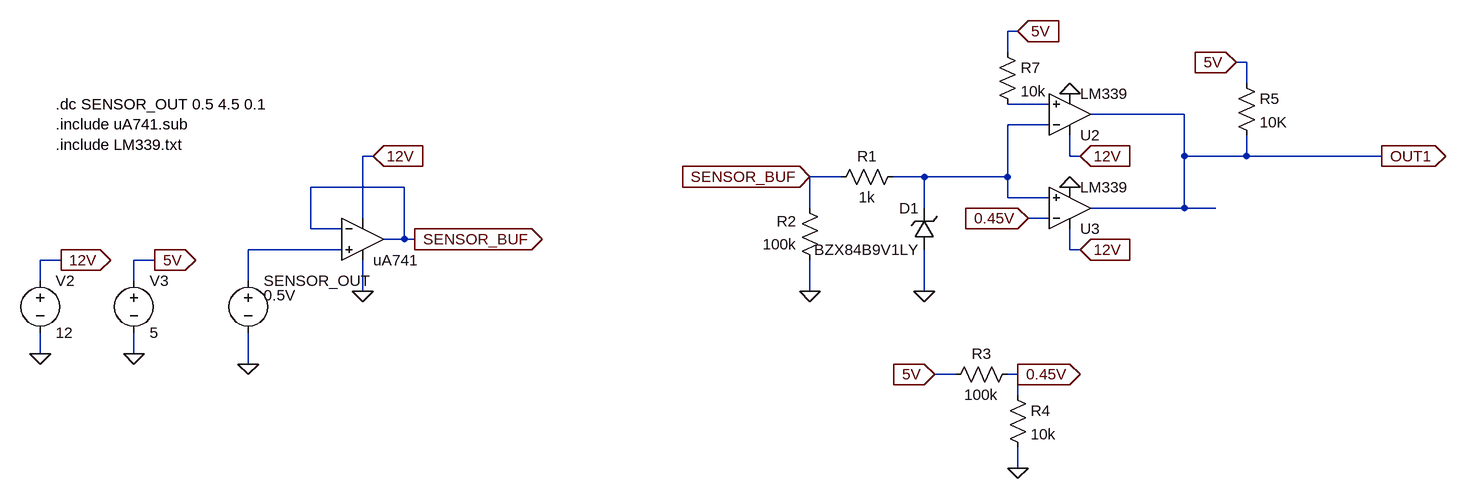
[diagram p0: schematic BSPD Sensors.asc]
BSPD Sensors.asc, the LTspice schematic file:
Version 4
SHEET 1 1704 752
WIRE 992 64 976 64
WIRE 976 96 976 64
WIRE 1344 112 1328 112
WIRE 1344 144 1344 112
WIRE 1040 176 976 176
WIRE 1248 192 1104 192
WIRE 1040 208 976 208
WIRE 0 256 -16 256
WIRE 1072 256 1072 224
WIRE 1088 256 1072 256
WIRE 1248 256 1248 192
WIRE 1344 256 1344 224
WIRE 1344 256 1248 256
WIRE 1552 256 1344 256
WIRE 720 288 672 288
WIRE 848 288 800 288
WIRE 976 288 976 208
WIRE 976 288 848 288
WIRE 48 304 -96 304
WIRE 976 320 976 288
WIRE 1040 320 976 320
WIRE 672 336 672 288
WIRE 848 336 848 288
WIRE 1248 336 1248 256
WIRE 1248 336 1104 336
WIRE 1296 336 1248 336
WIRE -16 352 -16 256
WIRE 1040 352 1008 352
WIRE -96 368 -96 304
WIRE -48 368 -96 368
WIRE 48 384 48 304
WIRE 48 384 16 384
WIRE 64 384 48 384
WIRE -48 400 -192 400
WIRE 1072 400 1072 368
WIRE 1088 400 1072 400
WIRE -480 416 -512 416
WIRE -336 416 -368 416
WIRE -512 448 -512 416
WIRE -368 448 -368 416
WIRE -192 448 -192 400
WIRE -16 464 -16 416
WIRE 672 464 672 416
WIRE 848 464 848 400
WIRE -512 560 -512 528
WIRE -368 560 -368 528
WIRE -192 576 -192 528
WIRE 896 592 864 592
WIRE 992 592 976 592
WIRE 992 624 992 592
WIRE 992 736 992 704
FLAG -512 560 0
FLAG -480 416 12V
IOPIN -480 416 Out
FLAG -368 560 0
FLAG -336 416 5V
IOPIN -336 416 Out
FLAG -192 576 0
FLAG 64 384 SENSOR_BUF
IOPIN 64 384 Out
FLAG -16 464 0
FLAG 0 256 12V
IOPIN 0 256 In
FLAG 672 464 0
FLAG 848 464 0
FLAG 672 288 SENSOR_BUF
IOPIN 672 288 In
FLAG 992 736 0
FLAG 864 592 5V
IOPIN 864 592 In
FLAG 992 592 0.45V
IOPIN 992 592 Out
FLAG 1008 352 0.45V
IOPIN 1008 352 In
FLAG 1072 304 0
FLAG 1072 160 0
FLAG 1088 256 12V
IOPIN 1088 256 In
FLAG 1088 400 12V
IOPIN 1088 400 In
FLAG 1328 112 5V
IOPIN 1328 112 In
FLAG 1552 256 OUT1
IOPIN 1552 256 Out
FLAG 992 64 5V
IOPIN 992 64 In
SYMBOL voltage -192 432 R0
WINDOW 3 24 38 Left 2
SYMATTR Value 0.5V
SYMATTR InstName SENSOR_OUT
SYMBOL OpAmps/opamp2 -16 320 R0
WINDOW 0 16 32 Invisible 2
SYMATTR InstName U1
SYMATTR Value uA741
SYMBOL voltage -512 432 R0
SYMATTR InstName V2
SYMATTR Value 12
SYMBOL voltage -368 432 R0
SYMATTR InstName V3
SYMATTR Value 5
SYMBOL Res 816 272 R90
WINDOW 0 0 56 VBottom 2
WINDOW 3 32 56 VTop 2
SYMATTR InstName R1
SYMATTR Value 1k
SYMBOL Res 688 432 R180
WINDOW 0 36 76 Left 2
WINDOW 3 36 40 Left 2
SYMATTR InstName R2
SYMATTR Value 100k
SYMBOL OpAmps/opamp2 1072 256 M180
SYMATTR InstName U2
SYMATTR Value LM339
SYMBOL OpAmps/opamp2 1072 400 M180
SYMATTR InstName U3
SYMATTR Value LM339
SYMBOL Res 880 608 R270
WINDOW 0 32 56 VTop 2
WINDOW 3 0 56 VBottom 2
SYMATTR InstName R3
SYMATTR Value 100k
SYMBOL Res 976 608 R0
SYMATTR InstName R4
SYMATTR Value 10k
SYMBOL Res 1328 128 R0
SYMATTR InstName R5
SYMATTR Value 10K
SYMBOL Res 960 80 R0
SYMATTR InstName R7
SYMATTR Value 10k
SYMBOL zener 864 400 R180
WINDOW 0 24 64 Left 2
WINDOW 3 24 0 Left 2
SYMATTR InstName D1
SYMATTR Value BZX84B9V1LY
TEXT -488 176 Left 2 !.dc SENSOR_OUT 0.5 4.5 0.1\n.include uA741.sub\n.include LM339.txt

The netlist it stands for:
* BSPD Sensors.asc
V§SENSOR_OUT N003 0 0.5V
XU1 N003 SENSOR_BUF 12V 0 SENSOR_BUF uA741  ; pins In+ In- V+ V- OUT
V2 12V 0 12
V3 5V 0 5
R1 N002 SENSOR_BUF 1k
R2 0 SENSOR_BUF 100k
XU2 N001 N002 12V 0 OUT1 LM339  ; pins In+ In- V+ V- OUT
XU3 N002 0.45V 12V 0 OUT1 LM339  ; pins In+ In- V+ V- OUT
R3 5V 0.45V 100k
R4 0.45V 0 10k
R5 5V OUT1 10K
R7 5V N001 10k
D1 0 N002 BZX84B9V1LY
.model D D
.lib standard.dio
.dc SENSOR_OUT 0.5 4.5 0.1
.include uA741.sub
.include LM339.txt
.backanno
.end